# EAGLE design OSO-MISC-21-016 Power Test (EAGLE 9.6.2)
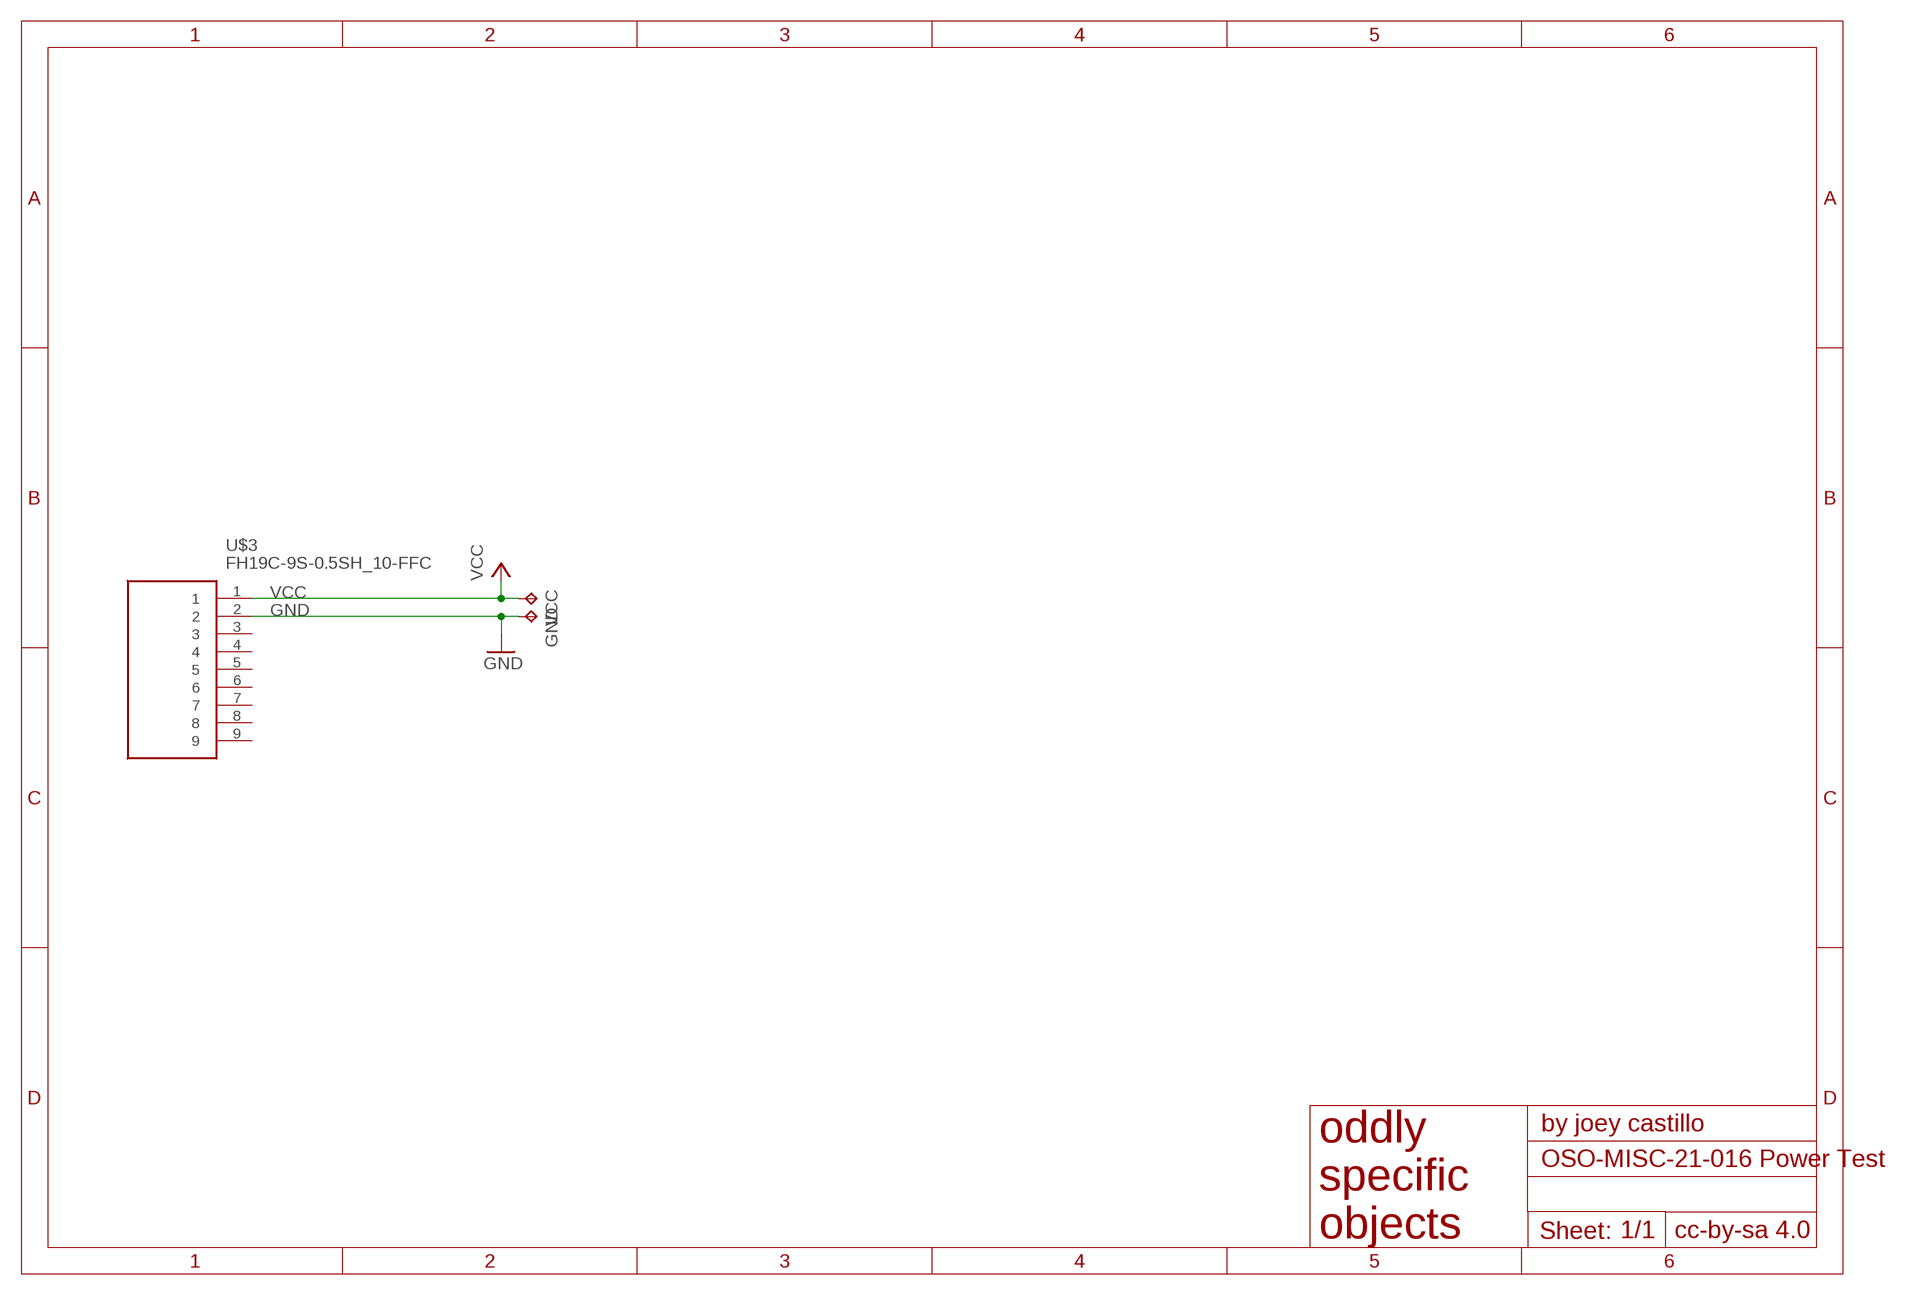
[diagram p0: schematic, sheet 1]

## Parts
GND  TPB2,54  [B2,54]
U$3  FH19C-9S-0.5SH_10-FFC  [FH19C9S05SH10-FFC]
VCC  TPB2,54  [B2,54]

## Nets
GND [gnd]: GND.TP U$3.2
VCC [power]: U$3.1 VCC.TP
Unconnected: U$3.3 U$3.4 U$3.5 U$3.6 U$3.7 U$3.8 U$3.9

## Library data of the parts
GND VCC = testpad:TP: Test pad
U$3 = FH19C-9S-0.5SH:FH19C-9S-0.5SH_10-FFC

## Net classes
0 default: width 0.203 mm
1 power: width 0.203 mm
2 gnd: width 0.203 mm

## Board
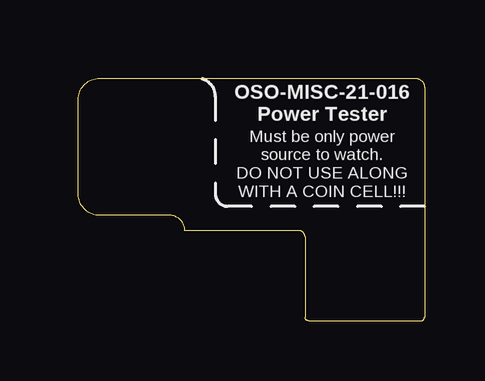
[diagram p1: board, top side]
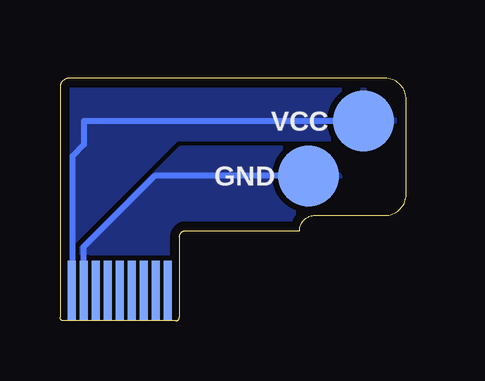
[diagram p2: board, bottom side, seen from below]

Size 14.43 x 10.1 mm. Coordinates in mm from the lower left corner, seen from the top.
Outline: 9.45,3.5 arc90 9.2,3.75 4.45,3.75 arc90 3.81,4.39 0.89,4.39 arc-90 0,5.28 0,9.21 arc-90 0.89,10.1 14.05,10.1 arc-90 14.43,9.72 14.43,3.5
Copper layers (1*16): Top 0.035559375mm / dielectric 1.6mm / Bottom 0.035559375mm
Design rules "oshpark-2layer *": minimum track width 6mil, minimum drill 10mil, track to track 6mil, track to pad 6mil, pad to pad 6mil, via to via 6mil, smd to smd 6mil, copper to edge 15mil, drill to drill 6mil, minimum pad ring 5mil, minimum via ring 5mil, stop-mask expansion 2.5mil, vias tented up to drill 12mil, thermal gap 10mil

### Footprints (pad centres in the part's own frame; a part is rotated, then mirrored left to right if it is on the bottom)
B2,54 = smd 2.54 x 2.54: TP 0,0
FH19C9S05SH10-FFC = smd 0.347 x 2.5 bottom: 1 2,-2.25; 2 1.5,-2.25; 3 1,-2.25; 4 0.5,-2.25; 5 0,-2.25; 6 -0.5,-2.25; 7 -1,-2.25; 8 -1.5,-2.25; 9 -2,-2.25

### Placement (x,y rotation side)
GND  4.06,6.04 0 bottom
U$3  11.94,3.5 0 top
VCC  1.78,8.33 0 bottom

### Tracks (layer width: path | path; a pad name or v marks a point on that pad's centre or on a via)
GND
  Bottom 0.254: GND.TP 10.48,6.04 13.44,3.08 U$3.2
  pour Bottom: 13.72,2.84 9.37,7.18 3.94,7.18 2.79,6.04 2.79,4.26 4.22,2.84
VCC
  Bottom 0.254: U$3.1 13.91,1.28 13.91,6.86 13.43,7.35 13.43,8.33 VCC.TP
  pour Bottom: 9.58,7.59 14,3.17 14.73,3.17 14.73,9.85 14.22,10.36 -0.25,10.36 -0.25,7.59

### Text on the board
tPlace: OSO-MISC-21-016 / Power Tester | Must be only power / source to watch. / DO NOT USE ALONG / WITH A COIN CELL!!!